# EAGLE design USB circuit (EAGLE 7.3.0)
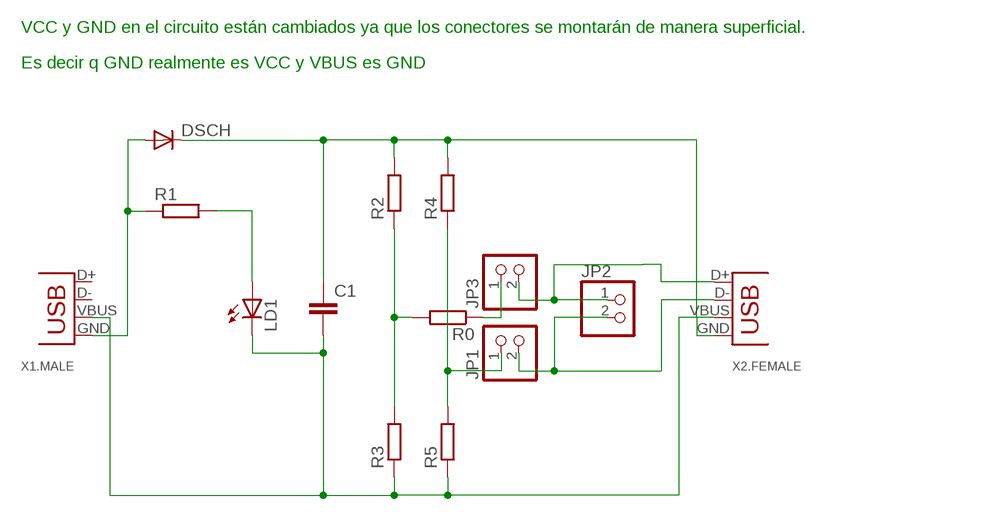
[diagram p0: schematic, sheet 1]

## Parts
C1  C-EUC1812  [C1812]
DSCH  DIODE-SOD123  [SOD123]
JP1  PINHD-1X2_2.54  [1X02]
JP2  PINHD-1X2_2.54  [1X02]
JP3  PINHD-1X2_2.54  [1X02]
LD1  LEDCHIPLED_1206  [CHIPLED_1206]
R0  R-EU_R1206  [R1206]
R1  R-EU_R1206  [R1206]
R2  R-EU_R1206  [R1206]
R3  R-EU_R1206  [R1206]
R4  R-EU_R1206  [R1206]
R5  R-EU_R1206  [R1206]
X1.MALE  USB-A-H  [USB-A-H]
X2.FEMALE  USB-A-H  [USB-A-H]

## Nets
GND: C1.2 LD1.C R3.1 R5.1 X1.MALE.VBUS X2.FEMALE.VBUS
N$1: JP1.1 R4.1 R5.2
N$2: C1.1 DSCH.C R2.2 R4.2 X2.FEMALE.GND
N$3: LD1.A R1.2
N$4: JP1.2 JP2.2 X2.FEMALE.D-
N$5: JP3.1 R0.1
N$7: R0.2 R2.1 R3.2
N$10: JP2.1 JP3.2 X2.FEMALE.D+
VCC: DSCH.A R1.1 X1.MALE.GND
Unconnected: X1.MALE.D+ X1.MALE.D-

## Notes on the sheet
- VCC y GND en el circuito están cambiados ya que los conectores se montarán de manera superficial.
- Es decir q GND realmente es VCC y VBUS es GND

## Library data of the parts
C1 = rcl:C-EU: CAPACITOR, European symbol
DSCH = diode:DIODE-: DIODE
JP1-JP3 = pinhead-1:PINHD-1X2: PIN HEADER
LD1 = led:LED: LED OSRAM: - CHIPLED LG R971, LG N971, LY N971, LG Q971, LY Q971, LO R971, LY R971 LH N974, LH R974 LS Q976, LO Q976, LY Q976 LO Q996 - Hyper CHIPLED LW Q18S LB Q993, LB Q99A, LB R99A - SideLED LS A670, LO A670, LY A670, LG A670, LP A670 LB A673, LV A673, LT A673, LW A673 LH A674 LY A675 LS A676, LA A676, LO A676, LY A676, LW A676 LS A679, LY A679, LG A679 - Hyper Micro SIDELED® LS Y876, LA Y876, LO Y876, LY Y876 LT Y87S - SmartLED LW L88C, LW L88S LB L89C, LB L89S, LG L890 LS L89K, LO L89K, LY L89K LS L896, LA L896, LO L896, LY L896 - TOPLED LS T670, LO T670, LY T670, LG T670, LP T670 LSG T670, LSP T670, LSY T670, LOP T670, LYG T670 LG T671, LOG T671, LSG T671 LB T673, LV T673, LT T673, LW T673 LH T674 LS T676, LA T676, LO T676, LY T676, LB T676, LH T676, LSB T676, LW T676 LB T67C, LV T67C, LT T67C, LS T67K, LO T67K, LY T67K, LW E67C LS E67B, LA E67B, LO E67B, LY E67B, LB E67C, LV E67C, LT E67C LW T67C LS T679, LY T679, LG T679 LS T770, LO T770, LY T770, LG T770, LP T770 LB T773, LV T773, LT T773, LW T773 LH T774 LS E675, LA E675, LY E675, LS T675 LS T776, LA T776, LO T776, LY T776, LB T776 LHGB T686 LT T68C, LB T68C - Hyper Mini TOPLED® LB M676 - Mini TOPLED Santana® LG M470 LS M47K, LO M47K, LY M47K Source: http://www.osram.convergy.de/
R0 R1-R5 = rcl:R-EU_: RESISTOR, European symbol
X1.MALE X2.FEMALE = con-usb-3:USB: USB Connectors

## Board
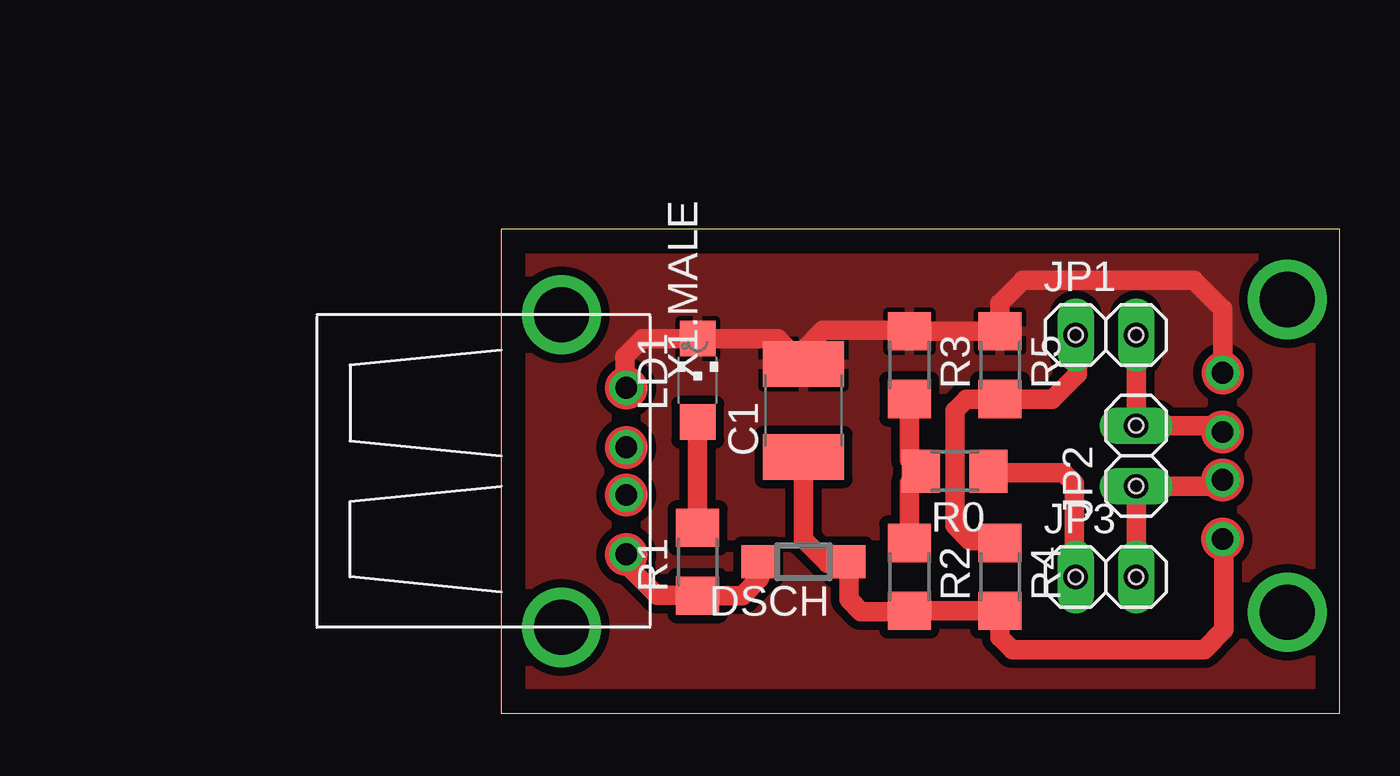
[diagram p1: board, top side]
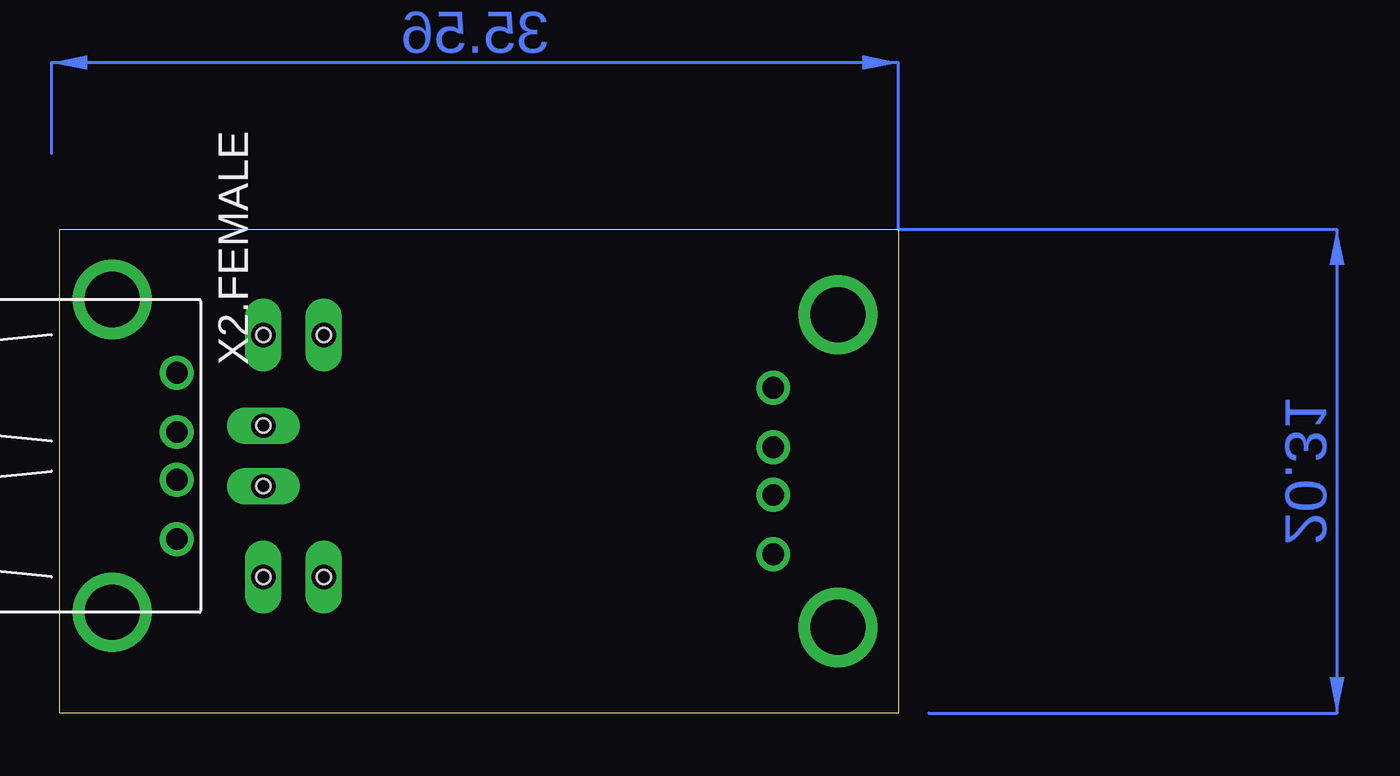
[diagram p2: board, bottom side, seen from below]

Size 35.23 x 20.31 mm. Coordinates in mm from the lower left corner, seen from the top.
Outline: 0,0 35.23,0 35.23,20.31 0,20.31 0,0
Copper layers (1*16): Top 0.035mm / dielectric 1.5mm / Bottom 0.035mm
Design rules "default *": minimum track width 10mil, minimum drill 24mil, track to track 14mil, track to pad 8mil, pad to pad 8mil, via to via 8mil, smd to smd 8mil, copper to edge 40mil, drill to drill 8mil, minimum pad ring 10mil, minimum via ring 8mil, stop-mask expansion 4mil, vias tented up to drill 0mil, thermal gap 8mil
Holes 0.6 mm at 26.67,12.07 26.67,15.88 24.13,15.88 26.67,9.53 24.13,5.72 26.67,5.72

### Footprints (pad centres in the part's own frame; a part is rotated, then mirrored left to right if it is on the bottom)
C1812 = smd 1.9 x 3.4: 1 -1.95,0; 2 1.95,0
SOD123 = smd 1.4 x 1.4: A 1.9,0; C -1.9,0
1X02 = drill 1.016 long: 1 -1.27,0; 2 1.27,0
CHIPLED_1206 = smd 1.5 x 1.5: A 0,-1.75; C 0,1.75
R1206 = smd 1.6 x 1.803: 1 -1.422,0; 2 1.422,0
USB-A-H = drill 0.914: D+ 2.718,-1.003; D- 2.718,1.003; GND 2.718,-3.493; VBUS 2.718,3.493 | drill 2.311: P$5 0,-6.566; P$6 0,6.566

### Placement (x,y rotation side)
C1  12.7,12.7 90 top
DSCH  12.7,6.35 180 top
JP1  25.4,15.88 0 top
JP2  26.67,10.8 90 top
JP3  25.4,5.72 0 top
LD1  8.26,13.97 0 top
R0  19.05,10.16 180 top
R1  8.26,6.35 90 top
R2  17.14,5.72 270 top
R3  17.14,14.61 270 top
R4  20.95,5.72 270 top
R5  20.95,14.61 270 top
X1.MALE  2.54,10.16 0 top
X2.FEMALE  33.02,10.8 0 bottom

### Tracks (layer width: path | path; a pad name or v marks a point on that pad's centre or on a via)
GND
  Top 0.813: X1.MALE.VBUS 5.21,13.7 5.21,14.99 5.94,15.72 LD1.C 11.63,15.72 C1.2 12.7,15.24 13.53,16.07 17.11,16.07 R3.1 R5.1 20.95,17.21 21.91,18.16 29.08,18.16 30.3,16.94 X2.FEMALE.VBUS
  pour Top: 0.64,19.69 34.92,19.69 34.92,11.43 34.92,0.64 0.64,0.64
N$1
  Top 0.813: JP1.1 24.19,15.81 24.19,14.22 23.15,13.18 R5.2 19.53,13.18 19.05,12.7 19.05,7.87 19.68,7.24 20.85,7.24 R4.1
N$2
  Top 0.813: C1.1 12.7,7.3 13.72,6.29 14.54,6.29 DSCH.C 14.6,4.77 15.11,4.25 17.11,4.25 R2.2 R4.2 20.95,3.18 21.46,2.67 29.53,2.67 30.35,3.49 30.35,7.25 X2.FEMALE.GND
N$3
  Top 0.813: LD1.A R1.2
N$4
  Top 0.813: JP1.2 JP2.2 30.04,12.07 X2.FEMALE.D-
N$5
  Top 0.813: R0.1 20.51,10.16 20.57,10.1 23.62,10.1 24.07,9.65 24.07,5.78 JP3.1
N$7
  Top 0.813: R3.2 17.14,10.64 R0.2 17.14,9.68 R2.1
N$10
  Top 0.813: JP3.2 JP2.1 30.04,9.53 X2.FEMALE.D+
VCC
  Top 0.813: X1.MALE.GND 5.26,6.24 6.54,4.95 8.23,4.95 R1.1 10.13,4.93 10.86,5.65 10.86,6.29 DSCH.A
(copper drawn outside any net)
  shapes: Bottom area x2, Top circle x8